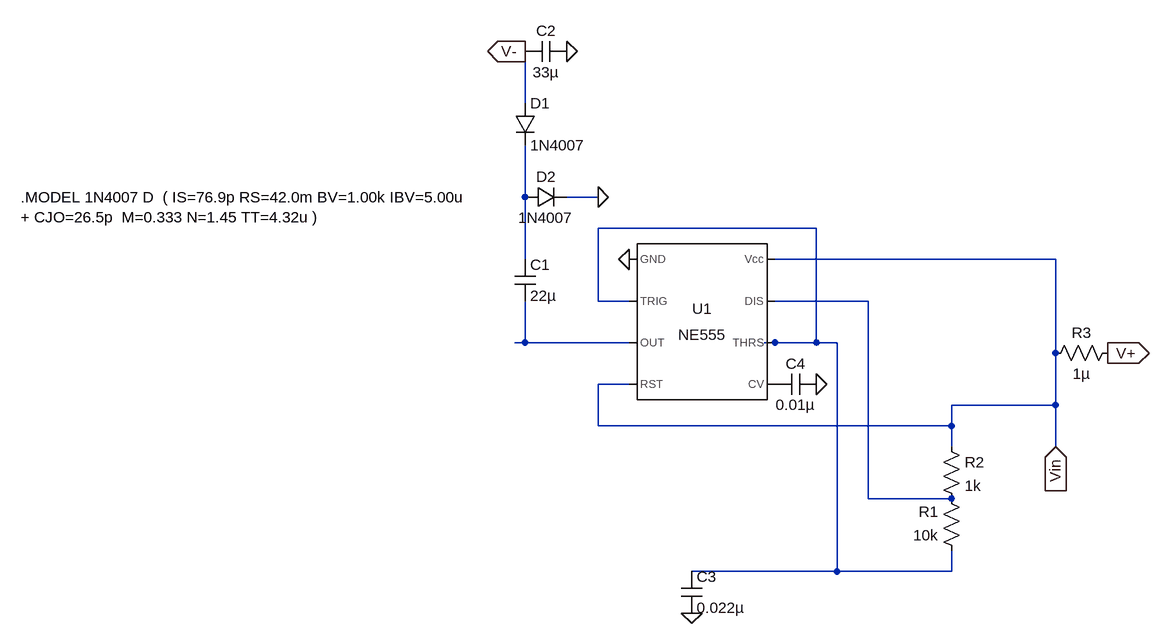
[diagram p0: schematic fuente_partida.asc]
fuente_partida.asc, the LTspice schematic file:
Version 4
SHEET 1 1068 680
WIRE -96 -160 -96 -240
WIRE -96 -16 -96 -96
WIRE 16 -16 -32 -16
WIRE 352 32 16 32
WIRE -96 80 -96 -16
WIRE 720 80 288 80
WIRE 16 144 16 32
WIRE 64 144 16 144
WIRE 432 144 288 144
WIRE -96 208 -96 144
WIRE -96 208 -112 208
WIRE 64 208 -96 208
WIRE 288 208 272 208
WIRE 352 208 352 32
WIRE 352 208 288 208
WIRE 384 208 352 208
WIRE 720 224 720 80
WIRE 64 272 16 272
WIRE 720 304 720 224
WIRE 720 304 560 304
WIRE 16 336 16 272
WIRE 560 336 560 304
WIRE 560 336 16 336
WIRE 560 368 560 336
WIRE 720 368 720 304
WIRE 432 448 432 144
WIRE 560 448 432 448
WIRE 384 560 384 208
WIRE 384 560 160 560
WIRE 560 560 560 528
WIRE 560 560 384 560
FLAG 64 80 0
FLAG 352 272 0
FLAG -32 -240 0
FLAG 16 -16 0
FLAG 160 624 0
FLAG -96 -240 V-
IOPIN -96 -240 Out
FLAG 720 368 Vin
IOPIN 720 368 In
FLAG 800 224 V+
IOPIN 800 224 Out
SYMBOL Misc\\NE555 176 176 R0
SYMATTR InstName U1
SYMBOL res 576 544 R180
WINDOW 0 36 76 Left 2
WINDOW 3 36 40 Left 2
SYMATTR InstName R1
SYMATTR Value 10k
SYMBOL res 544 352 R0
SYMATTR InstName R2
SYMATTR Value 1k
SYMBOL cap -112 80 R0
SYMATTR InstName C1
SYMATTR Value 22µ
SYMBOL diode -112 -160 R0
SYMATTR InstName D1
SYMATTR Value 1N4007
SYMBOL cap -32 -256 R90
WINDOW 0 0 32 VBottom 2
WINDOW 3 32 32 VTop 2
SYMATTR InstName C2
SYMATTR Value 33µ
SYMBOL diode -96 0 R270
WINDOW 0 32 32 VTop 2
WINDOW 3 0 32 VBottom 2
SYMATTR InstName D2
SYMATTR Value 1N4007
SYMBOL cap 144 560 R0
SYMATTR InstName C3
SYMATTR Value 0.022µ
SYMBOL cap 352 256 R90
WINDOW 0 0 32 VBottom 2
WINDOW 3 32 32 VTop 2
SYMATTR InstName C4
SYMATTR Value 0.01µ
SYMBOL res 816 208 R90
WINDOW 0 0 56 VBottom 2
WINDOW 3 32 56 VTop 2
SYMATTR InstName R3
SYMATTR Value 1µ
TEXT -872 -16 Left 2 !.MODEL 1N4007 D  ( IS=76.9p RS=42.0m BV=1.00k IBV=5.00u\n+ CJO=26.5p  M=0.333 N=1.45 TT=4.32u )

The netlist it stands for:
* fuente_partida.asc
XU1 0 N002 N004 Vin P001 N002 N003 Vin NE555  ; pins GND TRIG OUT RST CV THRS DIS Vcc
R1 N002 N003 10k
R2 Vin N003 1k
C1 N001 N004 22µ
D1 V- N001 1N4007
C2 0 V- 33µ
D2 N001 0 1N4007
C3 N002 0 0.022µ
C4 0 P001 0.01µ
R3 V+ Vin 1µ
.model D D
.lib standard.dio
.MODEL 1N4007 D  ( IS=76.9p RS=42.0m BV=1.00k IBV=5.00u
+ CJO=26.5p  M=0.333 N=1.45 TT=4.32u )
.lib NE555.sub
.backanno
.end